# EAGLE design sensor_board (EAGLE 7.2.0)
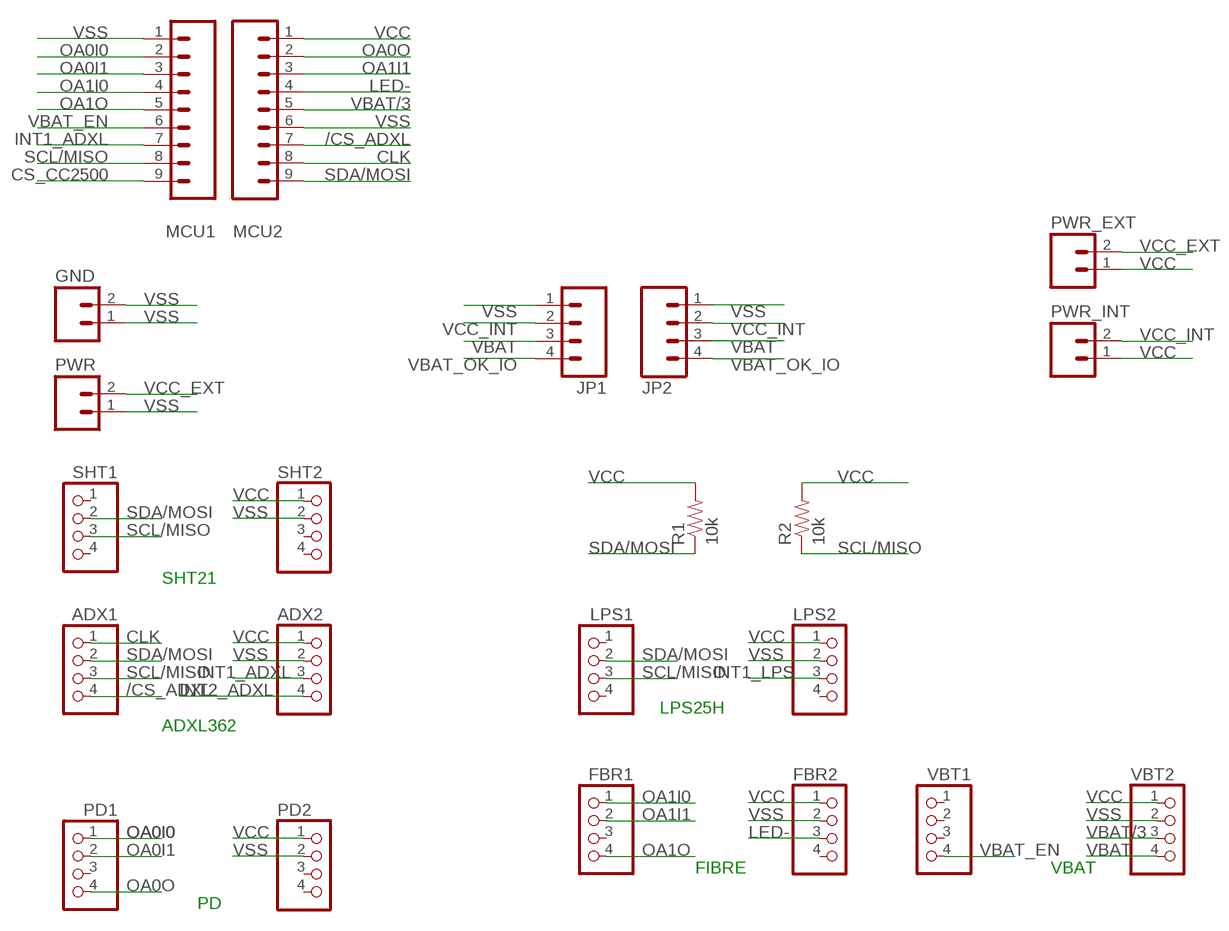
[diagram p0: schematic, sheet 1]

## Parts
ADX1  PINHD-1X4  [1X04]
ADX2  PINHD-1X4  [1X04]
FBR1  PINHD-1X4  [1X04]
FBR2  PINHD-1X4  [1X04]
GND  M02PTH  [1X02]
JP1  M04PTH  [1X04]
JP2  M04PTH  [1X04]
LPS1  PINHD-1X4  [1X04]
LPS2  PINHD-1X4  [1X04]
MCU1  M09  [1X09]
MCU2  M09  [1X09]
PD1  PINHD-1X4  [1X04]
PD2  PINHD-1X4  [1X04]
PWR  M02PTH  [1X02]
PWR_EXT  M02PTH  [1X02]
PWR_INT  M02PTH  [1X02]
R1  10k  10KOHM-1/4W5%(PTH)  [AXIAL-0.3]
R2  10k  10KOHM-1/4W5%(PTH)  [AXIAL-0.3]
SHT1  PINHD-1X4  [1X04]
SHT2  PINHD-1X4  [1X04]
VBT1  PINHD-1X4  [1X04]
VBT2  PINHD-1X4  [1X04]

## Nets
/CS_ADXL: ADX1.4 MCU2.7
CLK: ADX1.1 MCU2.8
CS_CC2500: MCU1.9
INT1_ADXL: ADX2.3 MCU1.7
INT1_LPS: LPS2.3
INT2_ADXL: ADX2.4
LED-: FBR2.3 MCU2.4
OA0I0: MCU1.2 PD1.1
OA0I1: MCU1.3 PD1.2
OA0O: MCU2.2 PD1.4
OA1I0: FBR1.1 MCU1.4
OA1I1: FBR1.2 MCU2.3
OA1O: FBR1.4 MCU1.5
SCL/MISO: ADX1.3 LPS1.3 MCU1.8 R2.P$1 SHT1.3
SDA/MOSI: ADX1.2 LPS1.2 MCU2.9 R1.P$1 SHT1.2
VBAT: JP1.3 JP2.3 VBT2.4
VBAT/3: MCU2.5 VBT2.3
VBAT_EN: MCU1.6 VBT1.4
VBAT_OK_IO: JP1.4 JP2.4
VCC: ADX2.1 FBR2.1 LPS2.1 MCU2.1 PD2.1 PWR_EXT.1 PWR_INT.1 R1.P$2 R2.P$2 SHT2.1 VBT2.1
VCC_EXT: PWR.2 PWR_EXT.2
VCC_INT: JP1.2 JP2.2 PWR_INT.2
VSS: ADX2.2 FBR2.2 GND.1 GND.2 JP1.1 JP2.1 LPS2.2 MCU1.1 MCU2.6 PD2.2 PWR.1 SHT2.2 VBT2.2
Unconnected: FBR1.3 FBR2.4 LPS1.1 LPS1.4 LPS2.4 PD1.3 PD2.3 PD2.4 SHT1.1 SHT1.4 SHT2.3 SHT2.4 VBT1.1 VBT1.2 VBT1.3

## Notes on the sheet
- SHT21
- LPS25H
- ADXL362
- FIBRE | VBAT
- PD

## Library data of the parts
ADX1 ADX2 FBR1 FBR2 LPS1 LPS2 PD1 PD2 SHT1 SHT2 VBT1 VBT2 = pinhead:PINHD-1X4: PIN HEADER
GND PWR PWR_EXT PWR_INT = SparkFun-Connectors:M02: Standard 2-pin 0.1" header. Use with - straight break away headers ( PRT-00116) - right angle break away headers (PRT-00553) - swiss pins (PRT-00743) - machine pins (PRT-00117) - female headers (PRT-00115) Molex polarized connector foot print use with: PRT-08233 with associated crimp pins and housings. 2.54_SCREWTERM for use with PRT-10571. 3.5mm Screw Terminal footprints for PRT-08084 5mm Screw Terminal footprints for use with PRT-08432
JP1 JP2 = SparkFun-Connectors:M04: Header 4 Standard 4-pin 0.1" header. Use with straight break away headers (SKU : PRT-00116), right angle break away headers (PRT-00553), swiss pins (PRT-00743), machine pins (PRT-00117), and female headers (PRT-00115). Molex polarized connector foot print use with SKU : PRT-08231 with associated crimp pins and housings. 1MM SMD Version SKU: PRT-10208
MCU1 MCU2 = SparkFun-Connectors:M09: Header 9 Standard 9-pin 0.1" header. Use with straight break away headers (SKU : PRT-00116), right angle break away headers (PRT-00553), swiss pins (PRT-00743), machine pins (PRT-00117), and female headers (PRT-00115).
R1 R2 = SparkFun-Resistors:10KOHM-1/4W5%(PTH): RES-09435; PROD_ID: RES-9435

## Board
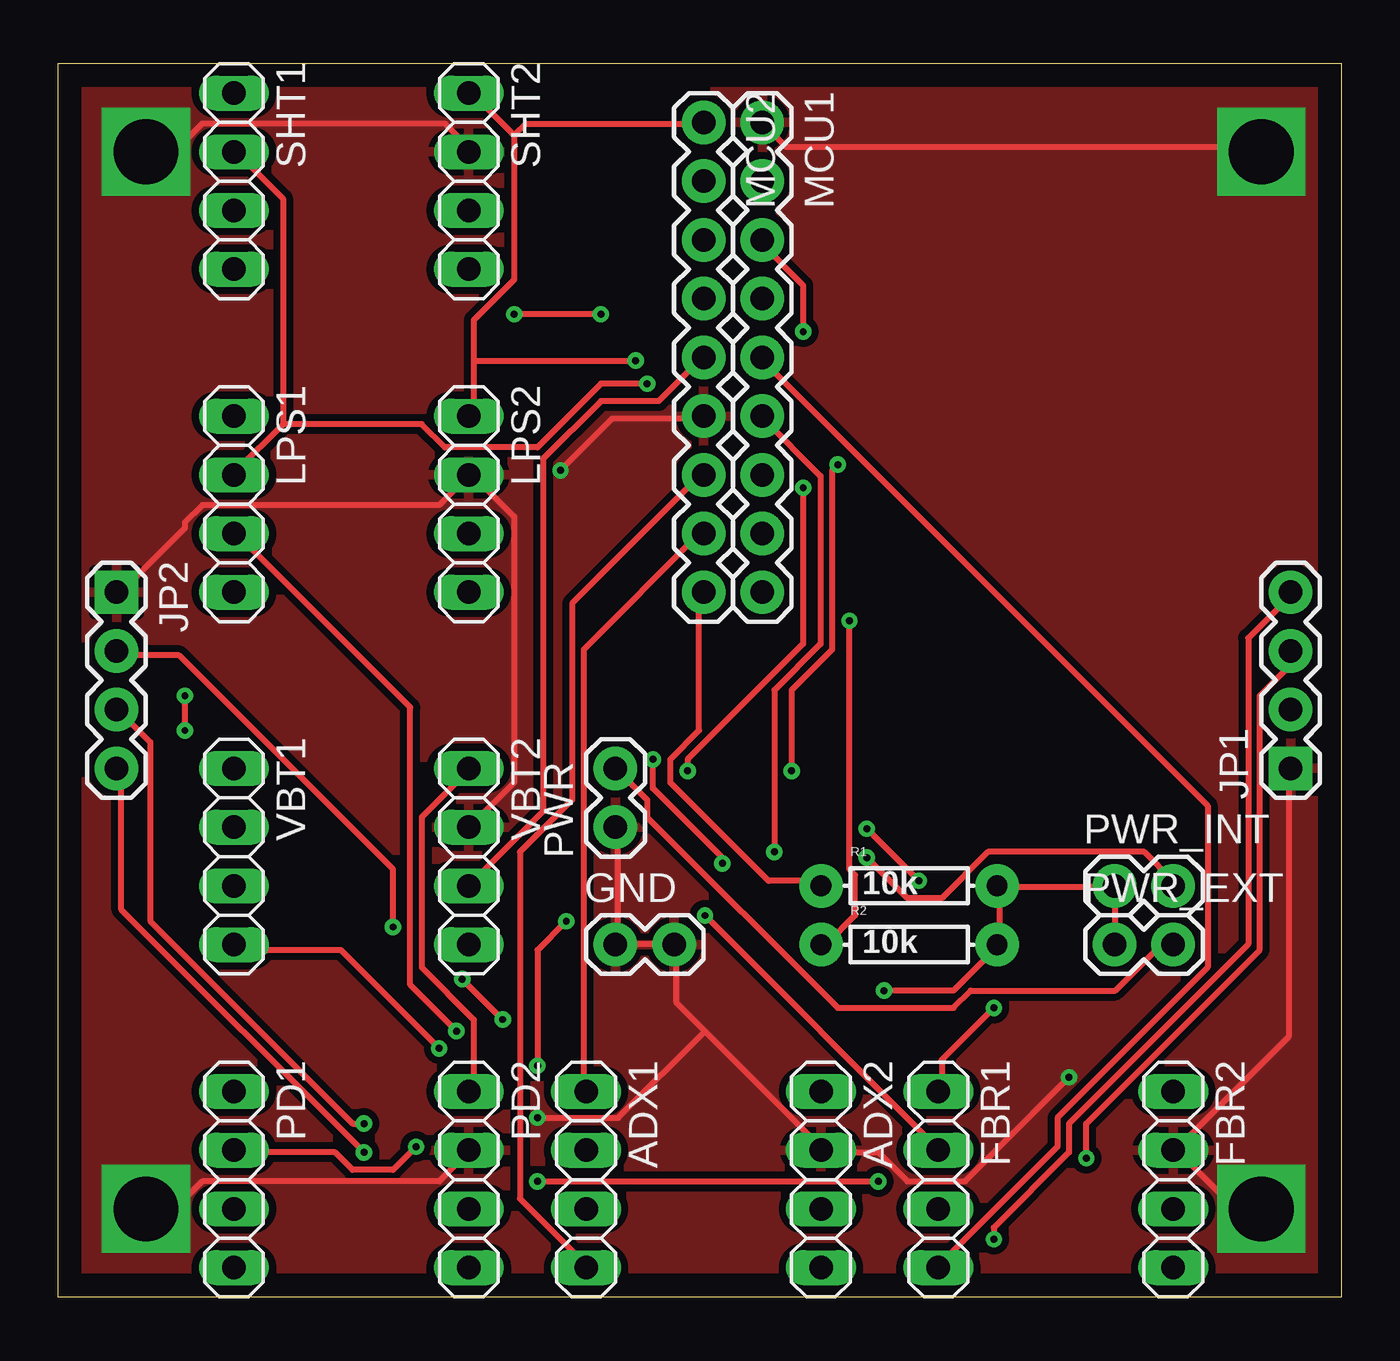
[diagram p1: board, top side]
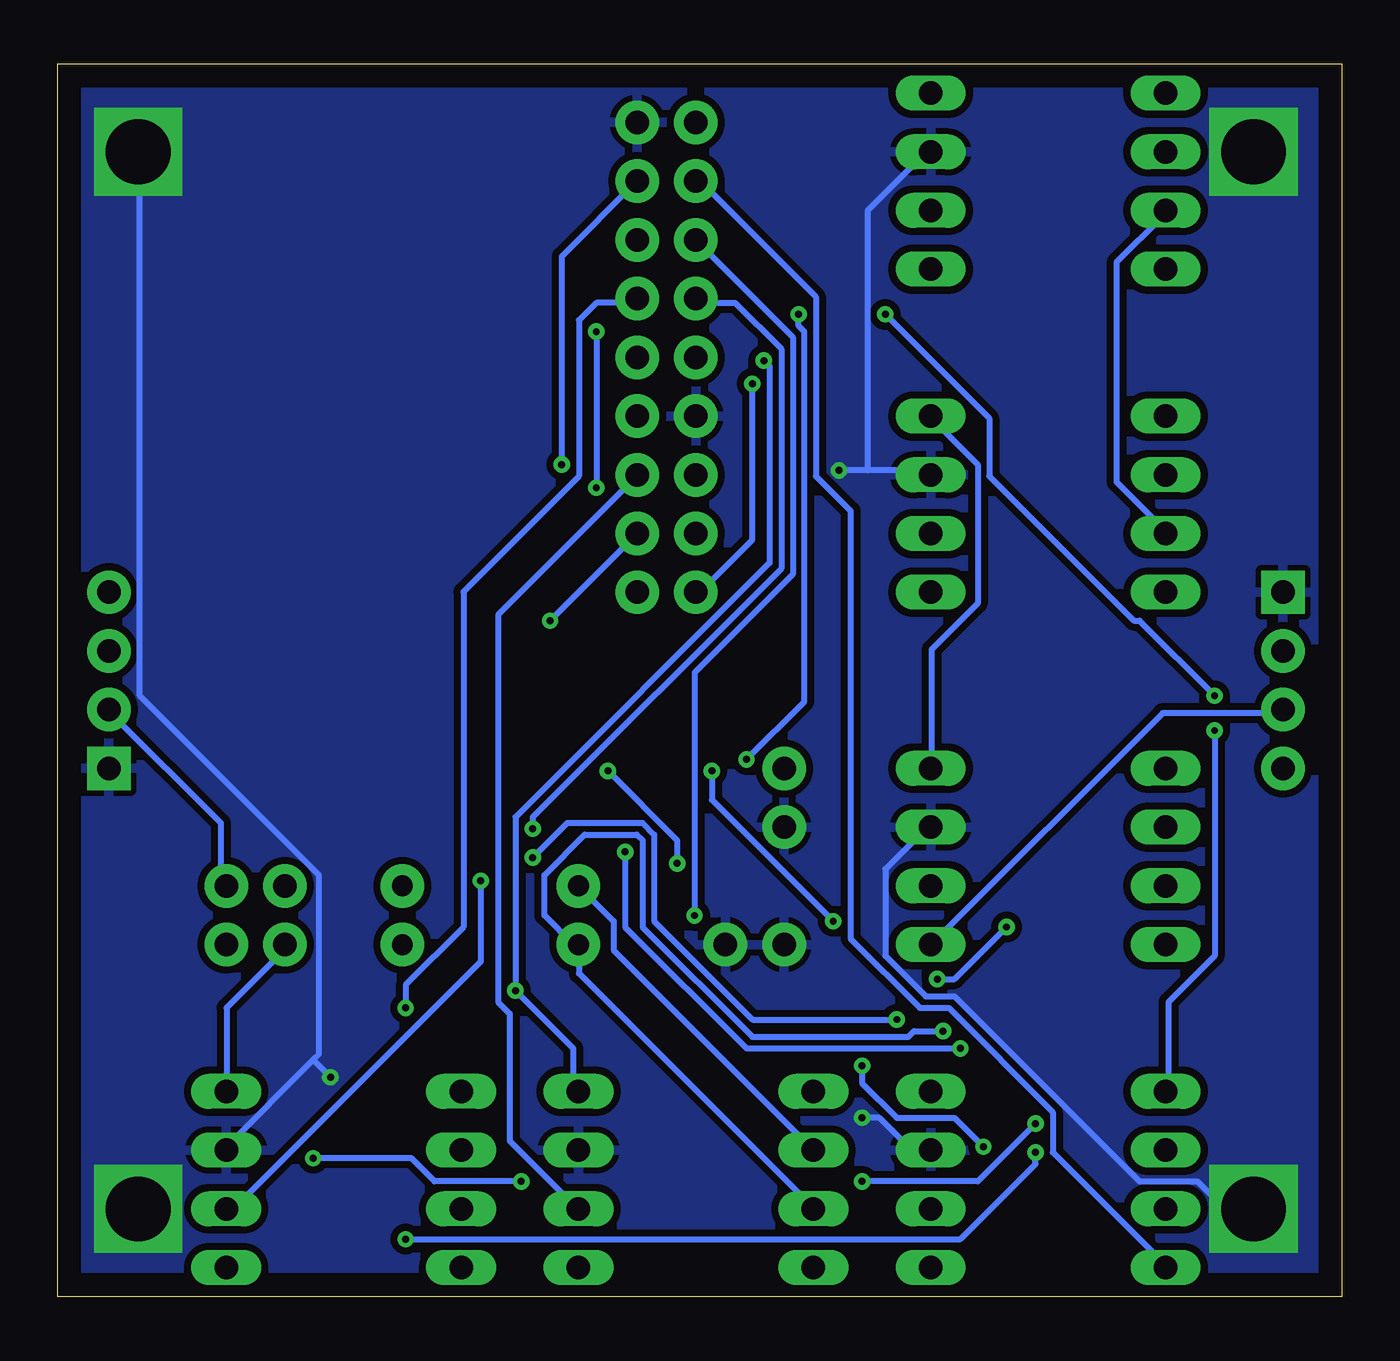
[diagram p2: board, bottom side, seen from below]

Size 55.55 x 53.33 mm. Coordinates in mm from the lower left corner, seen from the top.
Outline: 0,0 55.55,0 55.55,53.33 0,53.33 0,0
Copper layers (1*16): Top 0.035mm / dielectric 1.5mm / Bottom 0.035mm
Design rules "default *": minimum track width 0.25mm, minimum drill 0.3mm, track to track 0.25mm, track to pad 0.25mm, pad to pad 0.25mm, via to via 0.25mm, smd to smd 0.25mm, copper to edge 40mil, drill to drill 8mil, minimum pad ring 10mil, minimum via ring 8mil, stop-mask expansion 4mil, vias tented up to drill 0mil, thermal gap 10mil

### Footprints (pad centres in the part's own frame; a part is rotated, then mirrored left to right if it is on the bottom)
1X04 = drill 1.016 long: 1 -3.81,0; 2 -1.27,0; 3 1.27,0; 4 3.81,0
1X02 = drill 1.016 pad 1.88: 1 0,0; 2 2.54,0
1X04' = drill 1.016 pad 1.88 square: 1 0,0 | drill 1.016 pad 1.88: 2 2.54,0; 3 5.08,0; 4 7.62,0
1X09 = drill 1.016 pad 1.88: 1 0,0; 2 2.54,0; 3 5.08,0; 4 7.62,0; 5 10.16,0; 6 12.7,0; 7 15.24,0; 8 17.78,0; 9 20.32,0
AXIAL-0.3 = drill 0.9 pad 1.88: P$1 -3.81,0; P$2 3.81,0

### Placement (x,y rotation side)
ADX1  22.86,5.08 270 top
ADX2  33.02,5.08 270 top
FBR1  38.1,5.08 270 top
FBR2  48.26,5.08 270 top
GND  24.13,15.24 0 top
JP1  [1X04']  53.34,22.86 90 top
JP2  [1X04']  2.54,30.48 270 top
LPS1  7.62,34.29 270 top
LPS2  17.78,34.29 270 top
MCU1  30.48,50.8 270 top
MCU2  27.94,50.8 270 top
PD1  7.62,5.08 270 top
PD2  17.78,5.08 270 top
PWR  24.13,20.32 90 top
PWR_EXT  45.72,15.24 0 top
PWR_INT  45.72,17.78 0 top
R1  36.83,17.78 0 top
R2  36.83,15.24 0 top
SHT1  7.62,48.26 270 top
SHT2  17.78,48.26 270 top
VBT1  7.62,19.05 270 top
VBT2  17.78,19.05 270 top

### Tracks (layer width: path | path; a pad name or v marks a point on that pad's centre or on a via)
/CS_ADXL
  Top 0.25: ADX1.4 22.75,1.5 20,4.25 20,19.25 22.25,21.5 22.25,30 27.75,35.5 MCU2.7
CLK
  Top 0.25: ADX1.1 22.75,9 22.75,28 27.75,33 MCU2.8
INT1_ADXL
  Bottom 0.25: ADX2.3 33.25,4 36,6.75 36,12.25 36.5,12.75 36.5,29.5 30.5,35.5 MCU1.7
LED-  (via drill 0.3)
  Top 0.25: v35,20.25 v37.25,18
  Bottom 0.25: v37.25,18 37.25,14.5 47.75,4 48.25,4 FBR2.3 | v35,20.25 35,20.75 24.25,31.5 24.25,41 26.25,43 27.75,43 MCU2.4
OA0I0  (via drill 0.3)
  Top 0.25: v5.5,26 v5.5,24.5 | v23.5,42.5 v19.75,42.5 | v25.75,23.25 25.75,22 28.75,19 v28.75,18.75 | v31.75,22.75 31.75,26.25 33.5,28 33.5,35.75 v33.75,36
  Bottom 0.25: v5.5,24.5 5.5,14.75 7.5,12.75 7.5,9 PD1.1 | v5.5,26 8.75,29.25 9,29.25 15.25,35.5 15.25,38 v19.75,42.5 | v23.5,42.5 23.5,42 23.25,41.75 23.25,25.75 v25.75,23.25 | v28.75,18.75 28.75,19.75 v31.75,22.75 | v33.75,36 33.75,45 30.5,48.25 MCU1.2
OA0I1  (via drill 0.3)
  Top 0.25: v15.5,6.5 14.5,5.5 12.75,5.5 12,6.25 7.75,6.25 PD1.2 | v20.75,10 20.75,15 v22,16.25 | v27.25,22.75 27.25,23.25 32.25,28.25 v32.25,35 | v32.25,41.75 32.25,43.75 30.5,45.5 MCU1.3
  Bottom 0.25: v15.5,6.5 16.75,7.75 19.25,7.75 20.75,9.25 v20.75,10 | v22,16.25 27.25,21.5 v27.25,22.75 | v32.25,41.75 v32.25,35
OA0O
  Bottom 0.25: PD1.4 7.75,1.5 12.5,6.25 12.5,8 17,12.5 18.25,12.5 21.25,15.5 21.25,34 22.75,35.5 22.75,43.25 27.75,48.25 MCU2.2
OA1I0  (via drill 0.3)
  Top 0.25: v40.5,12.5 38.25,10.25 38.25,9 FBR1.1
  Bottom 0.25: v40.5,12.5 40.5,13.5 38,16 38,30.5 33,35.5 33,42.25 32.25,43 30.5,43 MCU1.4
OA1I1  (via drill 0.3)
  Top 0.25: v28,16.5 38,6.5 FBR1.2
  Bottom 0.25: v28,16.5 28,27 23.75,31.25 23.75,41.5 27.75,45.5 MCU2.3
OA1O
  Top 0.25: FBR1.4 38.25,1.5 43.25,6.5 43.25,7.75 49.75,14.25 49.75,21.25 30.5,40.5 MCU1.5
SCL/MISO  (via drill 0.3)
  Top 0.25: v34.25,29.25 34.25,18.5 34.5,18.25 34.5,16.5 33.25,15.25 R2.P$1 | v17.25,11.5 15.25,13.5 15.25,25.5 7.75,33 LPS1.3
  Bottom 0.25: LPS1.3 7.75,33.25 9.75,35.25 9.75,44.75 7.75,46.75 SHT1.3 | ADX1.3 23,4 33,14 33,15 R2.P$1 33.25,15.25 34.5,16.5 34.5,18.25 32.75,20 30.5,20 30.25,19.75 30.25,16 25.5,11.25 18.75,11.25 18.5,11.5 v17.25,11.5 | v34.25,29.25 MCU1.8
SDA/MOSI  (via drill 0.3)
  Top 0.25: 9.75,37.75 7.75,35.75 LPS1.2 | 9.75,37.75 9.75,47.5 7.75,49.5 SHT1.2 | MCU2.9 27.75,30.25 27.75,24.5 26.5,23.25 26.5,22.25 30.75,18 33,18 R1.P$1 | 9.75,37.75 15.75,37.75 16.75,36.75 20.75,36.75 23.5,39.5 v25.5,39.5
  Bottom 0.25: ADX1.2 23,6.5 31.5,15 31.5,16.25 33,17.75 R1.P$1 | v25.5,39.5 25.5,32.75 27.75,30.5 MCU2.9
VBAT  (via drill 0.3)
  Top 0.25: v44.5,6 44.5,7.5 52,15 52,26 53.25,27.25 53.25,27.75 JP1.3 | v20.75,5 v35.5,5 | v13.25,7.5 12.75,7.5 4,16.25 4,24 2.75,25.25 JP2.3
  Bottom 0.25: VBT2.4 17.75,15.25 7.75,25.25 2.75,25.25 JP2.3 | v44.5,6 40.25,6 39.25,5 v35.5,5 | v20.75,5 15.75,5 v13.25,7.5
VBAT/3
  Top 0.25: VBT2.3 21,21 21,36.25 23.5,38.75 26,38.75 27.75,40.5 MCU2.5
VBAT_EN  (via drill 0.3)
  Top 0.25: v16.5,10.75 12.25,15 7.75,15 VBT1.4 | v31,19.25 31,26.25 33,28.25 33,35.5 30.5,38 MCU1.6
  Bottom 0.25: v16.5,10.75 25.75,10.75 31,16 v31,19.25
VBAT_OK_IO  (via drill 0.3)
  Top 0.25: v13.25,6.25 2.75,16.75 2.75,22.75 JP2.4 | v40.5,2.5 40.5,3 43.75,6.25 43.75,7.5 51.5,15.25 51.5,28.5 53.25,30.25 JP1.4
  Bottom 0.25: v13.25,6.25 13.25,5.75 16.5,2.5 v40.5,2.5
VCC  (via drill 0.3)
  Top 0.25: PWR_EXT.1 45.75,15.25 45.75,17.75 PWR_INT.1 45.5,17.75 40.75,17.75 | v35.75,13.25 38.75,13.25 40.5,15 R2.P$2 40.75,15.25 40.75,17.75 | 40.75,17.75 R1.P$2 | PD2.1 18,9 18,12 15.75,14.25 15.75,20.75 17.75,22.75 VBT2.1 | 18,40.5 18,42.25 19.75,44 19.75,50.25 | 18,40.5 18,38.25 LPS2.1 | 19.75,50.25 18,52 SHT2.1 | 19.75,50.25 20.25,50.75 27.75,50.75 MCU2.1 | 18,40.5 v25,40.5
  Bottom 0.25: FBR2.1 48.25,9 48.25,12.5 45.75,15 PWR_EXT.1 | ADX2.1 33.25,9 33.25,10.75 v35.75,13.25 35.75,20.75 24.75,31.75 24.75,40.25 v25,40.5 | VBT2.1 17.75,23 17.75,28 15.75,30 15.75,36 17.75,38 LPS2.1
VCC_EXT
  Top 0.25: PWR_EXT.2 48.25,15 47.5,15 45.75,13.25 39.5,13.25 38.75,12.5 33.75,12.5 25.5,20.75 25.5,21.5 24.25,22.75 PWR.2
VCC_INT  (via drill 0.3)
  Top 0.25: v14.5,16 14.5,18.5 5.25,27.75 2.75,27.75 JP2.2 | v19.25,12 v17.5,13.75 | v35,19 36.75,17.25 38.25,17.25 40.25,19.25 47,19.25 48.25,18 PWR_INT.2
  Bottom 0.25: PWR_INT.2 48.5,18 48.5,20.5 53.25,25.25 JP1.2 | v14.5,16 16.75,13.75 v17.5,13.75 | v19.25,12 25.5,12 29.75,16.25 29.75,20 30.25,20.5 33.5,20.5 v35,19
VSS  (via drill 0.3, 2.8)
  Top 0.25: v52.07,49.53 52,49.5 52,48.25 v52.07,49.53 | 3.75,49.5 v3.81,49.53 | 52.25,4 v52.07,3.81 52,4 50.75,4 48.5,6.25 FBR2.2 48.5,6.5 53.25,11.25 53.25,22.75 JP1.1 | 4,49.5 v3.81,49.53 | 4,3.75 v3.81,3.81 4,4 5.25,4 6.25,5 16.5,5 17.75,6.25 PD2.2 | v52.07,49.53 52,49.75 31.5,49.75 30.5,50.75 MCU1.1 | 28,11.5 26.75,12.75 26.75,15 GND.2 26.5,15.25 24.25,15.25 | 28,11.5 33,6.5 ADX2.2 33.25,6.25 35.5,6.25 36.75,5 39.25,5 v43.75,9.5 | 24.25,15.25 24.25,20.25 PWR.1 | 24.25,15.25 GND.1 | v3.81,49.53 4,49.75 5.25,49.75 6.25,50.75 16.75,50.75 17.75,49.75 SHT2.2 | VBT2.2 18,20.5 19.75,22.25 19.75,33.75 18,35.5 LPS2.2 17.75,35.5 16.5,34.25 6.25,34.25 5.5,33.5 5.5,33.25 2.75,30.5 JP2.1 | v21.75,35.75 24,38 27.75,38 MCU2.6 | 28,11.5 24.25,7.75 v20.75,7.75
  Bottom 0.25: 4,49.75 v3.81,49.53 4,49.5 | 52,48.25 52,49.5 v52.07,49.53 52,48.25 | 52,4 v52.07,3.81 | 3.75,4 v3.81,3.81 | 4,3.75 v3.81,3.81 | 52,48.25 52,26 44.25,18.25 44.25,10.5 44.5,10.25 | 44.5,10.25 48.25,6.5 FBR2.2 | 20.5,35.75 18,35.75 LPS2.2 | 20.5,35.75 v21.75,35.75 | 20.5,35.75 20.5,47 18,49.5 SHT2.2 | v3.81,3.81 4,4 5.25,4 6.25,5 8.75,5 16.75,13 18,13 19.75,14.75 19.75,18.5 18,20.25 VBT2.2 | v20.75,7.75 20,7.75 18.75,6.5 18,6.5 PD2.2 | v43.75,9.5 44.5,10.25
  pour Bottom (isolate 0.305, rank 6): 64.77,58.42 -49.53,57.15 -46.99,-1.27 63.5,-7.62
  pour Top (isolate 0.305): -19.05,63.5 76.2,58.42 77.47,-10.16 -17.78,-5.08